# EAGLE design io2db9 (EAGLE 9.0.0)
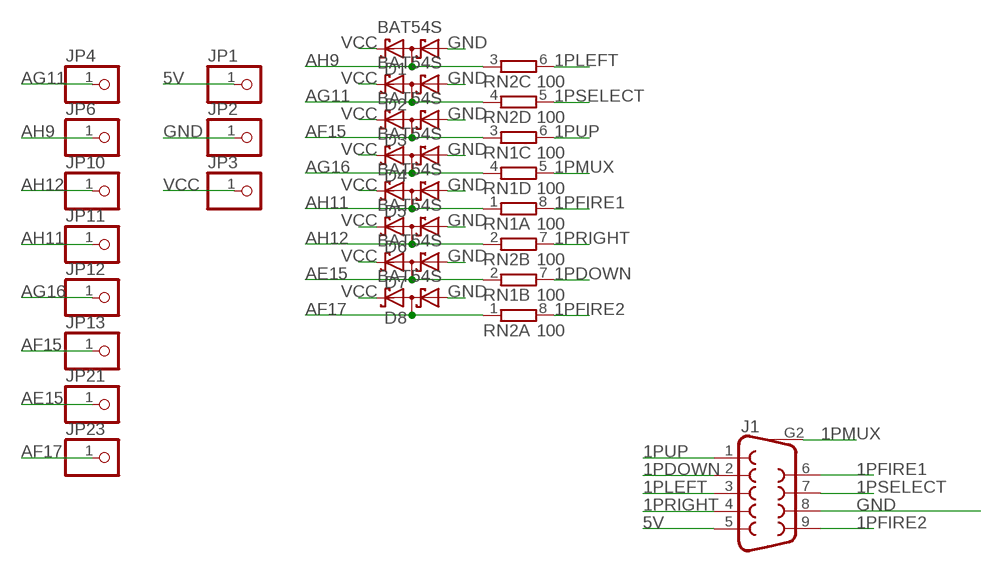
[diagram p0: schematic, sheet 1]

## Parts
D1  BAT54S  [SOT23]
D2  BAT54S  [SOT23]
D3  BAT54S  [SOT23]
D4  BAT54S  [SOT23]
D5  BAT54S  [SOT23]
D6  BAT54S  [SOT23]
D7  BAT54S  [SOT23]
D8  BAT54S  [SOT23]
J1  SPARKFUN-CONNECTORS_DB9MALE  [SPARKFUN-CONNECTORS_DB9_MALE]
JP1  PINHD-1X1  [1X01]
JP2  PINHD-1X1  [1X01]
JP3  PINHD-1X1  [1X01]
JP4  PINHD-1X1  [1X01]
JP6  PINHD-1X1  [1X01]
JP10  PINHD-1X1  [1X01]
JP11  PINHD-1X1  [1X01]
JP12  PINHD-1X1  [1X01]
JP13  PINHD-1X1  [1X01]
JP21  PINHD-1X1  [1X01]
JP23  PINHD-1X1  [1X01]
RN1  100  4R-N0603-ARC  [0603-ARC]
RN2  100  4R-N0603-ARC  [0603-ARC]

## Nets
1PDOWN: J1.2 RN1.7
1PFIRE1: J1.6 RN1.8
1PFIRE2: J1.9 RN2.8
1PLEFT: J1.3 RN2.6
1PMUX: J1.G2 RN1.5
1PRIGHT: J1.4 RN2.7
1PSELECT: J1.7 RN2.5
1PUP: J1.1 RN1.6
5V: J1.5 JP1.1
AE15: D7.3(C1A2) JP21.1 RN1.2
AF15: D3.3(C1A2) JP13.1 RN1.3
AF17: D8.3(C1A2) JP23.1 RN2.1
AG11: D2.3(C1A2) JP4.1 RN2.4
AG16: D4.3(C1A2) JP12.1 RN1.4
AH9: D1.3(C1A2) JP6.1 RN2.3
AH11: D5.3(C1A2) JP11.1 RN1.1
AH12: D6.3(C1A2) JP10.1 RN2.2
GND [power]: D1.1(A1) D2.1(A1) D3.1(A1) D4.1(A1) D5.1(A1) D6.1(A1) D7.1(A1) D8.1(A1) J1.8 JP2.1
VCC: D1.2(C2) D2.2(C2) D3.2(C2) D4.2(C2) D5.2(C2) D6.2(C2) D7.2(C2) D8.2(C2) JP3.1

## Library data of the parts
D1-D8 = diode:BAT54S: Schottky Diodes Pin connection corrected 2011-05-04 Source: Fairchild .. BAT54.pdf
J1 = mister_io2:SPARKFUN-CONNECTORS_DB9: DB9 Connector Standard DB9 (D-Sub 9) serial connector. Can be used for CAN bus as well as RS485 and RS232. Footprint production proven. Here is the female version connector we sell at SparkFun: 9 Pin Female Serial Connector - PCB Mount <https://www.sparkfun.com/products/429> (PRT-00429) This connector has been used on the following SparkFun products: SparkFun RS232 Shifter - SMD <https://www.sparkfun.com/products/449> (PRT-00449) SparkFun RS232 Shifter SMD (No DB9) <https://www.sparkfun.com/products/8780> (PRT-08780); PROD_ID: CONN-09904
JP1-JP4 JP6 JP10-JP13 JP21 JP23 = pinhead:PINHD-1X1: PIN HEADER
RN1 RN2 = resistor-dil:4R-N: Array Chip Resistor Source: RS Component / Phycomp; OC_FARNELL: unknown; OC_NEWARK: unknown

## Net classes
0 default: width 0.178 mm, clearance 0.178 mm
1 power: width 0.305 mm, clearance 0.178 mm to class 0, clearance 0.229 mm

## Board
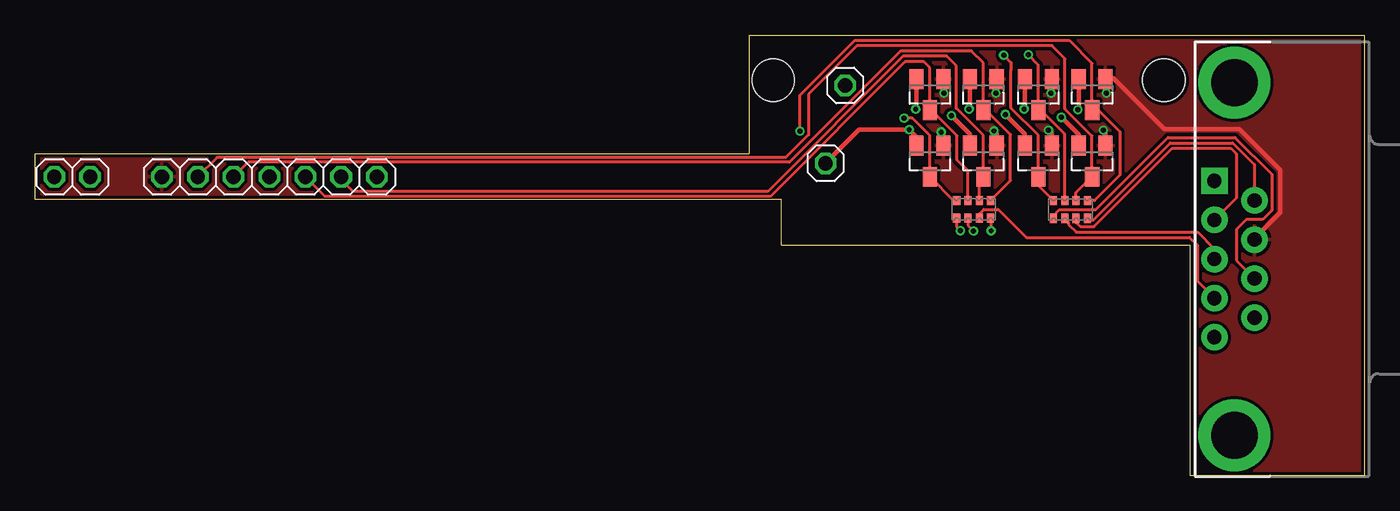
[diagram p1: board, top side]
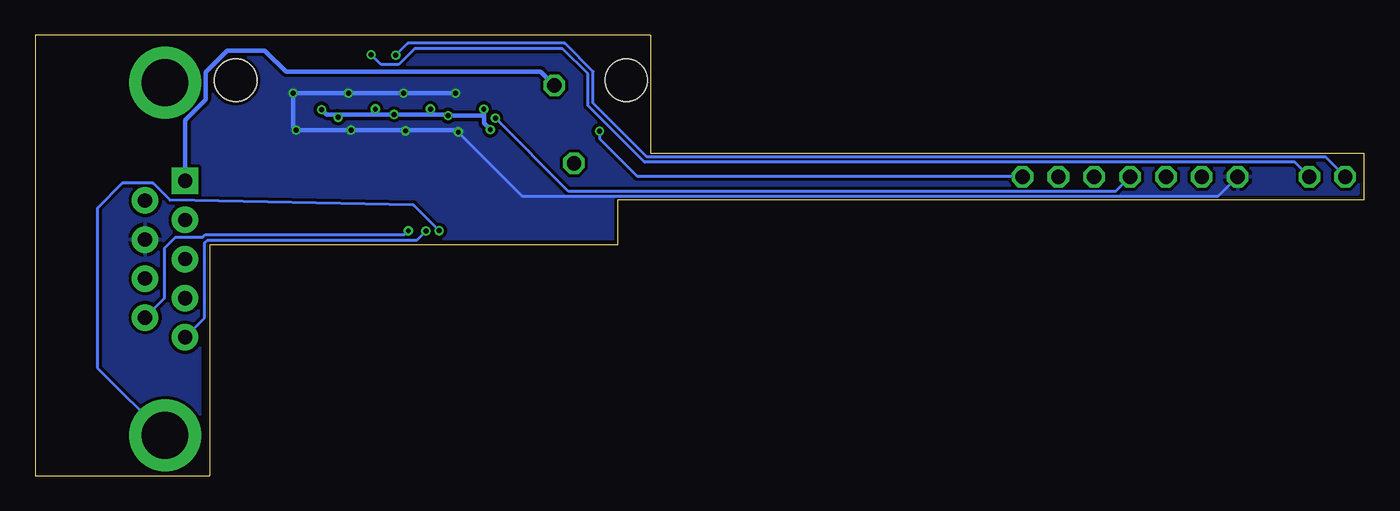
[diagram p2: board, bottom side, seen from below]

Size 94.15 x 31.22 mm. Coordinates in mm from the lower left corner, seen from the top.
Outline: 94.14,31.22 94.14,0 81.8,0 81.8,16.34 52.86,16.34 52.86,19.57 0,19.57 0,22.82 50.56,22.82 50.56,31.22 94.14,31.22
Copper layers (1*16): Top 0.035mm / dielectric 1.5mm / Bottom 0.035mm
Design rules "seedstudio_Fusion_eagle_rule_v1.1": minimum track width 6mil, minimum drill 12mil, track to track 6mil, track to pad 6mil, pad to pad 6mil, via to via 6mil, smd to smd 0mil, copper to edge 10mil, drill to drill 10mil, minimum pad ring 10mil, minimum via ring 6mil, stop-mask expansion 2mil, vias tented up to drill 100mil, thermal gap 10mil
Holes 3 mm at 79.96,28.03 52.27,28.03

### Footprints (pad centres in the part's own frame; a part is rotated, then mirrored left to right if it is on the bottom)
SOT23 = smd 1 x 1.4: 1 -0.95,-1.1; 2 0.95,-1.1; 3 0,1.1
SPARKFUN-CONNECTORS_DB9_MALE = drill 1.016 pad 1.88: 1 5.54,-1.42; 2 2.77,-1.42; 3 0,-1.42; 4 -2.77,-1.42; 6 4.15,1.42; 7 1.38,1.42; 8 -1.38,1.42; 9 -4.15,1.42 | drill 1.016 pad 1.88 square: 5 -5.54,-1.42 | drill 3.302 pad 5.08: G1 -12.5,0; G2 12.5,0
1X01 = drill 1.016 octagon: 1 0,0
0603-ARC = smd 0.5 x 0.65: 1 -1.2,-0.625; 2 -0.4,-0.625; 3 0.4,-0.625; 4 1.2,-0.625; 5 1.2,0.625; 6 0.4,0.625; 7 -0.4,0.625; 8 -1.2,0.625

### Placement (x,y rotation side)
D1  71.06,27.01 180 top
D2  71.06,22.29 180 top
D3  63.37,27.01 180 top
D4  63.37,22.29 180 top
D5  67.16,27.01 180 top
D6  74.87,22.29 180 top
D7  67.16,22.29 180 top
D8  74.87,27.01 180 top
J1  84.95,15.35 270 top
JP1  57.37,27.66 0 top
JP2  8.97,21.18 0 top
JP3  55.98,22.15 0 top
JP4  1.35,21.18 0 top
JP6  3.89,21.18 0 top
JP10  11.51,21.18 0 top
JP11  14.05,21.18 0 top
JP12  16.59,21.18 0 top
JP13  19.13,21.18 0 top
JP21  21.67,21.18 0 top
JP23  24.21,21.18 0 top
RN1  66.47,18.88 180 top
RN2  73.33,18.87 180 top

### Tracks (layer width: path | path; a pad name or v marks a point on that pad's centre or on a via)
1PDOWN
  Top 0.203: J1.2 82.31,13.8 82.31,16.34 81.77,16.88 70.21,16.88 68.21,18.87 67.2,18.87 66.87,18.55 RN1.7
1PFIRE1  (via drill 0.35)
  Top 0.203: RN1.8 67.72,18.22 v67.72,17.36
  Bottom 0.203: J1.6 84.99,12.59 84.99,16.13 84.21,16.9 82.28,16.9 82.11,17.08 67.99,17.08 v67.72,17.36
1PFIRE2
  Top 0.203: RN2.8 74.65,18.13 74.94,18.13 80.4,23.58 84.84,23.58 86.37,22.05 J1.9
1PLEFT
  Top 0.203: RN2.6 73.2,17.98 73.2,17.81 73.75,17.26 82.35,17.26 82.35,17.25 83.53,16.08 J1.3
1PMUX  (via drill 0.35)
  Top 0.203: RN1.5 65.27,17.63 v65.55,17.36
  Bottom 0.203: v65.55,17.36 67.36,19.18 84.59,19.52 85.8,20.72 87.98,20.72 89.75,18.95 89.75,7.65 J1.G2
1PRIGHT
  Top 0.203: RN2.7 73.73,17.95 74.04,17.64 75,17.64 80.56,23.2 84.68,23.2 85.07,22.81 85.07,19.66 J1.4
1PSELECT
  Top 0.203: RN2.5 72.13,18.42 72.56,18.85 75.13,18.85 80.24,23.96 84.99,23.96 87.59,21.37 87.59,18.81 86.94,18.16 85.8,18.16 85.09,17.45 85.09,15.25 J1.7
1PUP  (via drill 0.35)
  Top 0.203: RN1.6 66.07,17.74 v66.47,17.34
  Bottom 0.203: v66.47,17.34 67.11,16.7 81.95,16.7 82.16,16.49 82.16,11.19 J1.1
5V
  Bottom 0.305: J1.5 83.53,25.21 82.08,26.67 82.08,28.6 80.55,30.14 77.89,30.14 76.39,28.64 58.34,28.64 JP1.1
AE15
  Top 0.203: RN1.2 66.87,20.9 D7.3 67.16,24.13 65.25,26.03 65.25,29.04 64.58,29.72 61.46,29.72 51.9,20.15 22.53,20.15 21.67,21.02 JP21.1
AF15
  Top 0.203: RN1.3 66.07,21.61 65.3,22.38 65.3,24.09 63.48,25.91 D3.3 63.37,28.92 62.95,29.34 61.62,29.34 52.07,19.79 20.52,19.79 JP13.1
AF17  (via drill 0.35)
  Top 0.203: RN2.1 75.04,19.5 76.85,21.31 76.85,24.38 75.32,25.91 D8.3 74.87,29.24 73.24,30.86 58.06,30.86 54.17,26.96 v54.17,24.42
  Bottom 0.203: v54.17,24.42 54.17,23.88 51.51,21.22 24.24,21.22 JP23.1
AG11  (via drill 0.35)
  Top 0.203: RN2.4 71.06,20.57 D2.3 71.06,24.13 69.13,26.06 69.13,28.77 69.13,29.28 v68.61,29.8
  Bottom 0.203: JP4.1 2.73,22.58 50.81,22.58 54.62,26.39 54.62,28.64 56.63,30.64 67.76,30.64 v68.61,29.8
AG16  (via drill 0.35)
  Top 0.203: D4.3 63.37,24.12 62.15,25.34 v61.55,25.34 | 63.37,20.9 D4.3 | D4.3 65.05,19.51 RN1.4
  Bottom 0.203: JP12.1 17.62,20.15 56.37,20.15 v61.55,25.34
AH9  (via drill 0.35)
  Top 0.203: RN2.3 72.93,24.22 71.24,25.91 D1.3 71.06,29.11 v70.34,29.84
  Bottom 0.203: JP6.1 4.92,22.21 50.98,22.21 55,26.23 55,28.48 56.79,30.26 67.28,30.26 68.41,29.13 69.63,29.13 v70.34,29.84
AH11
  Top 0.203: RN1.1 69.09,20.93 69.09,24.18 67.36,25.91 D5.3 67.16,29.26 66.32,30.1 61.3,30.1 53.42,22.21 15.07,22.21 JP11.1
AH12
  Top 0.203: RN2.2 73.73,20.05 D6.3 74.87,24.08 72.95,26 72.95,29.55 72.02,30.48 58.22,30.48 54.77,27.03 54.77,24.17 53.16,22.55 12.88,22.55 JP10.1
GND  (via drill 0.35)
  Top 0.305: D8.1 75.88,28.18 | 75.88,28.18 v75.88,27.11 | v64.36,27.11 64.36,28.15 D3.1 | D1.1 71.96,28.16 v71.96,27.11 | v64.18,24.36 64.32,24.21 D4.1 | v67.91,24.44 68.11,24.24 D7.1 | D2.1 72.01,24.27 v71.78,24.5 | D6.1 75.82,24.35 v75.67,24.5 | J1.8 86.37,16.82 88.2,18.66 88.2,21.65 85.29,24.56 79.98,24.56 76.36,28.18 75.88,28.18 | v68.05,27.11 68.11,27.18 D5.1
  Bottom 0.203: v64.18,24.36 64.18,24.34 59.63,19.79 10.36,19.79 JP2.1
  Bottom 0.305: v64.36,27.11 v68.05,27.11 v71.96,27.11 v75.88,27.11 75.88,24.71 v75.67,24.5 v71.78,24.5 | v64.18,24.36 64.31,24.5 67.97,24.5 | v71.78,24.5 67.97,24.5 | v67.91,24.44 67.97,24.5 | 71.88,24.4 v71.78,24.5
  pour Bottom: 94.01,30.94 50.9,30.94 50.9,22.49 0.43,22.49 0.43,22.39 0.43,19.93 53.16,19.93 53.16,16.79 82.51,16.79 82.51,0.28 94.01,0.28 94.01,30.54 93.9,30.54
  pour Top: 94.01,30.94 50.9,30.94 50.9,22.49 0.43,22.49 0.43,22.39 0.43,19.93 53.16,19.93 53.16,16.79 82.51,16.79 82.51,0.28 94.01,0.28 94.01,30.54 93.9,30.54
VCC  (via drill 0.35)
  Top 0.305: 62.42,23.57 D4.2 62.42,24.01 v61.91,24.52 58.35,24.52 JP3.1 | D3.2 62.42,26.04 v62.37,25.98 | v64.91,25.52 66.21,24.22 D7.2 | v66.15,25.99 66.21,26.05 D5.2 | D2.2 70.11,24.21 v68.72,25.6 | D1.2 70.11,26.05 v70.05,25.99 | D6.2 73.92,24.17 v72.69,25.4 | D8.2 73.92,26 v73.86,25.94
  Bottom 0.305: 72.73,25.6 70.22,25.6 | 70.22,25.6 v68.72,25.6 66.17,25.6 | 66.17,25.6 64.91,25.6 v64.91,25.52 62.4,25.52 62.37,25.55 | 62.46,25.89 v62.37,25.98 62.37,25.55 | v66.15,25.99 66.17,25.98 66.17,25.6 | v70.05,25.99 70.22,25.83 70.22,25.6 | v72.69,25.4 72.69,25.55 72.73,25.6 | 62.37,25.55 62.37,24.98 v61.91,24.52 | v73.86,25.94 73.52,25.6 72.73,25.6